# EAGLE design DIGITAL_40G_ACCELEROMETER_REV_1 (EAGLE 9.6.2)
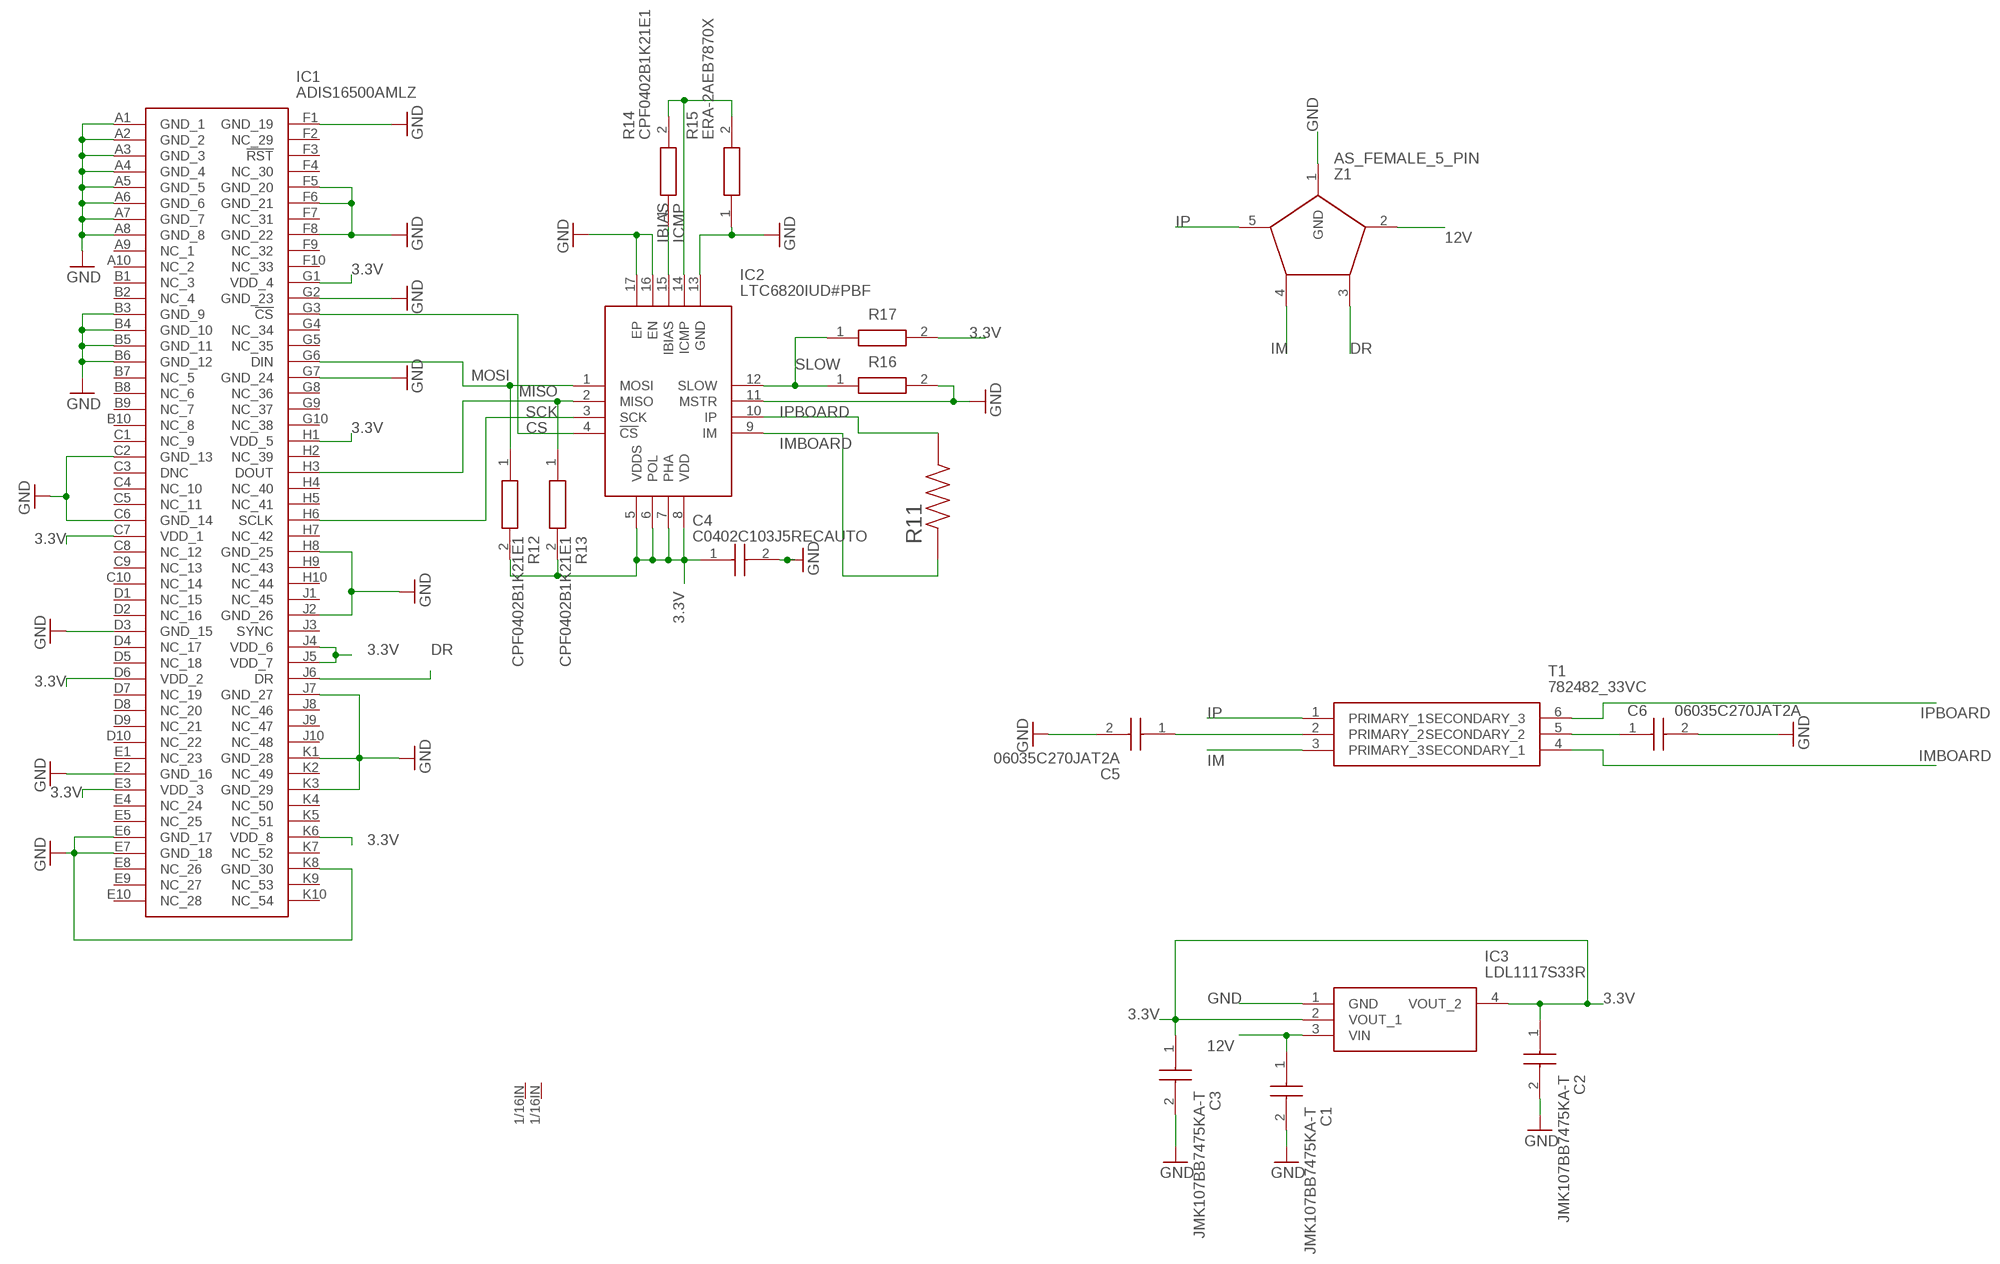
[diagram p0: schematic, sheet 1]

## Parts
C1  JMK107BB7475KA-T  [CAPC1608X90N]
C2  JMK107BB7475KA-T  [CAPC1608X90N]
C3  JMK107BB7475KA-T  [CAPC1608X90N]
C4  C0402C103J5RECAUTO  [CAPC1005X55N]
C5  06035C270JAT2A  [CAPC1608X90N]
C6  06035C270JAT2A  [CAPC1608X90N]
IC1  ADIS16500AMLZ  [BGA100C127P10X10_1500X1500X608]
IC2  LTC6820IUD#PBF  [QFN50P300X300X80-17N]
IC3  LDL1117S33R  [SOT230P700X180-4N]
R11  100  TNPW0402100RBYEP  [RESC1005X40N]
R12  CPF0402B1K21E1  [RESC1005X35N]
R13  CPF0402B1K21E1  [RESC1005X35N]
R14  CPF0402B1K21E1  [RESC1005X35N]
R15  ERA-2AEB7870X  [ERA2AED122X]
R16  CRG0402ZR  [RESC1005X40N]
R17  CRG0402ZR  [RESC1005X40N]
T1  782482_33VC  [DIP1016W60P254L914H635Q6N]
U$3  THROUGH_HOLE  [1/16TH_BOLT]
U$4  THROUGH_HOLE  [1/16TH_BOLT]
Z1  AS_FEMALE_5_PIN  [AS_FEMALE_5_PIN]

## Nets
3.3V: C2.1 C3.1 C4.1 IC1.C7(VDD_1) IC1.D6(VDD_2) IC1.E3(VDD_3) IC1.G1(VDD_4) IC1.H1(VDD_5) IC1.J4(VDD_6) IC1.J5(VDD_7) IC1.K6(VDD_8) IC2.5(VDDS) IC2.6(POL) IC2.7(PHA) IC2.8(VDD) IC3.2(VOUT_1) IC3.4(VOUT_2) R12.2 R13.2 R17.2
12V: C1.1 IC3.3(VIN) Z1.2
CS: IC1.G3(!CS) IC2.4(!CS)
DR: IC1.J6(DR) Z1.3
GND: C1.2 C2.2 C3.2 C4.2 C5.2 C6.2 IC1.A1(GND_1) IC1.A2(GND_2) IC1.A3(GND_3) IC1.A4(GND_4) IC1.A5(GND_5) IC1.A6(GND_6) IC1.A7(GND_7) IC1.A8(GND_8) IC1.B3(GND_9) IC1.B4(GND_10) IC1.B5(GND_11) IC1.B6(GND_12) IC1.C2(GND_13) IC1.C6(GND_14) IC1.D3(GND_15) IC1.E2(GND_16) IC1.E6(GND_17) IC1.E7(GND_18) IC1.F1(GND_19) IC1.F5(GND_20) IC1.F6(GND_21) IC1.F8(GND_22) IC1.G2(GND_23) IC1.G7(GND_24) IC1.H8(GND_25) IC1.J2(GND_26) IC1.J7(GND_27) IC1.K1(GND_28) IC1.K3(GND_29) IC1.K8(GND_30) IC2.11(MSTR) IC2.13(GND) IC2.16(EN) IC2.17(EP) IC3.1(GND) R15.1 R16.2 Z1.1(GND)
IBIAS: IC2.15(IBIAS) R14.1
ICMP: IC2.14(ICMP) R14.2 R15.2
IM: T1.3(PRIMARY_3) Z1.4
IMBOARD: IC2.9(IM) R11.1 T1.4(SECONDARY_1)
IP: T1.1(PRIMARY_1) Z1.5
IPBOARD: IC2.10(IP) R11.2 T1.6(SECONDARY_3)
MISO: IC1.H3(DOUT) IC2.2(MISO) R13.1
MOSI: IC1.G6(DIN) IC2.1(MOSI) R12.1
N$1: C6.1 T1.5(SECONDARY_2)
N$2: C5.1 T1.2(PRIMARY_2)
SCK: IC1.H6(SCLK) IC2.3(SCK)
SLOW: IC2.12(SLOW) R16.1 R17.1
Unconnected: IC1.A9(NC_1) IC1.A10(NC_2) IC1.B1(NC_3) IC1.B2(NC_4) IC1.B7(NC_5) IC1.B8(NC_6) IC1.B9(NC_7) IC1.B10(NC_8) IC1.C1(NC_9) IC1.C3(DNC) IC1.C4(NC_10) IC1.C5(NC_11) IC1.C8(NC_12) IC1.C9(NC_13) IC1.C10(NC_14) IC1.D1(NC_15) IC1.D2(NC_16) IC1.D4(NC_17) IC1.D5(NC_18) IC1.D7(NC_19) IC1.D8(NC_20) IC1.D9(NC_21) IC1.D10(NC_22) IC1.E1(NC_23) IC1.E4(NC_24) IC1.E5(NC_25) IC1.E8(NC_26) IC1.E9(NC_27) IC1.E10(NC_28) IC1.F2(NC_29) IC1.F3(!RST) IC1.F4(NC_30) IC1.F7(NC_31) IC1.F9(NC_32) IC1.F10(NC_33) IC1.G4(NC_34) IC1.G5(NC_35) IC1.G8(NC_36) IC1.G9(NC_37) IC1.G10(NC_38) IC1.H2(NC_39) IC1.H4(NC_40) IC1.H5(NC_41) IC1.H7(NC_42) IC1.H9(NC_43) IC1.H10(NC_44) IC1.J1(NC_45) IC1.J3(SYNC) IC1.J8(NC_46) IC1.J9(NC_47) IC1.J10(NC_48) IC1.K2(NC_49) IC1.K4(NC_50) IC1.K5(NC_51) IC1.K7(NC_52) IC1.K9(NC_53) IC1.K10(NC_54) U$3.1/16IN(THROUGH_HOLE) U$4.1/16IN(THROUGH_HOLE)

## Library data of the parts
C1-C3 = SamacSys_Parts:JMK107BB7475KA-T: Taiyo Yuden JMK107BB7475KA-T 4.7F MLCC 6.3V dc +/-10% Tolerance SMD Source: Datasheet <https://componentsearchengine.com/Datasheets/1/JMK107BB7475KA-T.pdf>; DESCRIPTION: Taiyo Yuden JMK107BB7475KA-T 4.7F MLCC 6.3V dc +/-10% Tolerance SMD; HEIGHT: 0.9mm; MANUFACTURER_NAME: TAIYO YUDEN; MANUFACTURER_PART_NUMBER: JMK107BB7475KA-T; MOUSER_PART_NUMBER: 963-JMK107BB7475KA-T; MOUSER_PRICE-STOCK: https://www.mouser.co.uk/ProductDetail/Taiyo-Yuden/JMK107BB7475KA-T/?qs=Va%252BXcMGJzEswq6AuVGoq3Q%3D%3D
C4 = SamacSys_Parts:C0402C103J5RECAUTO: Multilayer Ceramic Capacitors MLCC - SMD/SMT 50V 0.01uF X7R 0402 5% AEC-Q200 Source: Datasheet <https://www.kemet.com/specsheet/C0402C103J5RECAUTO>; DESCRIPTION: Multilayer Ceramic Capacitors MLCC - SMD/SMT 50V 0.01uF X7R 0402 5% AEC-Q200; HEIGHT: 0.55mm; MANUFACTURER_NAME: Kemet; MANUFACTURER_PART_NUMBER: C0402C103J5RECAUTO; MOUSER_PART_NUMBER: 80-C0402C103J5RECAUT; MOUSER_PRICE-STOCK: https://www.mouser.co.uk/ProductDetail/KEMET/C0402C103J5RECAUTO?qs=MLItCLRbWsyFnqqp7gkmMQ%3D%3D
C5 C6 = SamacSys_Parts:06035C270JAT2A: Capacitor, 0603 27PF +/-5% 50V Source: Datasheet <https://componentsearchengine.com/Datasheets/1/06031A100FAT2A.pdf>; DESCRIPTION: Capacitor, 0603 27PF +/-5% 50V; HEIGHT: 0.9mm; MANUFACTURER_NAME: AVX; MANUFACTURER_PART_NUMBER: 06035C270JAT2A
IC1 = SamacSys_Parts:ADIS16500AMLZ: IMUs - Inertial Measurement Units 6 DOF Prec IMU, 40g (2000 DPS DNR) Source: Datasheet <https://componentsearchengine.com/Datasheets/1/ADIS16500AMLZ.pdf>; DESCRIPTION: IMUs - Inertial Measurement Units 6 DOF Prec IMU, 40g (2000 DPS DNR); HEIGHT: 6.077mm; MANUFACTURER_NAME: Analog Devices; MANUFACTURER_PART_NUMBER: ADIS16500AMLZ; MOUSER_PART_NUMBER: 584-ADIS16500AMLZ; MOUSER_PRICE-STOCK: https://www.mouser.co.uk/ProductDetail/Analog-Devices/ADIS16500AMLZ?qs=wnTfsH77Xs6CVAUqSdwQ2w%3D%3D
IC2 = SamacSys_Parts:LTC6820IUD#PBF: Interface - Specialized isoSPI Iso Communications Int Source: Datasheet <https://www.analog.com/media/en/technical-documentation/data-sheets/6820fb.pdf>; DESCRIPTION: Interface - Specialized isoSPI Iso Communications Int; HEIGHT: 0.8mm; MANUFACTURER_NAME: Analog Devices; MANUFACTURER_PART_NUMBER: LTC6820IUD#PBF; MOUSER_PART_NUMBER: 584-LTC6820IUD#PBF; MOUSER_PRICE-STOCK: https://www.mouser.co.uk/ProductDetail/Analog-Devices/LTC6820IUDPBF?qs=hVkxg5c3xu96S49pvln6gg%3D%3D
IC3 = SamacSys_Parts:LDL1117S33R: STMICROELECTRONICS - LDL1117S33R - LDO, FIXED, 3.3V, 1.2A, SOT-223-3 Source: Datasheet <https://componentsearchengine.com/Datasheets/2/LDL1117S33R.pdf>; DESCRIPTION: STMICROELECTRONICS - LDL1117S33R - LDO, FIXED, 3.3V, 1.2A, SOT-223-3; HEIGHT: 1.8mm; MANUFACTURER_NAME: STMicroelectronics; MANUFACTURER_PART_NUMBER: LDL1117S33R; MOUSER_PART_NUMBER: 511-LDL1117S33R; MOUSER_PRICE-STOCK: https://www.mouser.co.uk/ProductDetail/STMicroelectronics/LDL1117S33R?qs=AQlKX63v8Rt9Bf6AWSrbFg%3D%3D
R11 = SamacSys_Parts:TNPW0402100RBYEP: Check availability <https://pricing.snapeda.com/parts/TNPW0402100RBYEP/Vishay/view-part?ref=eda>; AVAILABILITY: In Stock; DESCRIPTION: 100 Ohms ±0.1% 0.063W, 1/16W Chip Resistor 0402 (1005 Metric) Anti-Sulfur, Automotive AEC-Q200, Moisture Resistant Thin Film; MF: Vishay; MP: TNPW0402100RBYEP; PACKAGE: 1005 Stackpole; PRICE: None; PURCHASE-URL: https://pricing.snapeda.com/search/part/TNPW0402100RBYEP/?ref=eda
R12-R14 = SamacSys_Parts:CPF0402B1K21E1: TE Connectivity CPF Series Precision Thin Film Surface Mount Resistor 0402 Case 1.21k +/-0.1% 0.063W +/-25ppm/C Source: Datasheet; DESCRIPTION: TE Connectivity CPF Series Precision Thin Film Surface Mount Resistor 0402 Case 1.21k +/-0.1% 0.063W +/-25ppm/C; HEIGHT: 0.35mm; MANUFACTURER_NAME: TE Connectivity; MANUFACTURER_PART_NUMBER: CPF0402B1K21E1
R15 = SamacSys_Parts:ERA-2AEB7870X: Metal Thin Film Chip Resistor, 0402, 0.063W Source: Datasheet <http://industrial.panasonic.com/cdbs/www-data/pdf/RDM0000/AOA0000C307.pdf>; DESCRIPTION: Metal Thin Film Chip Resistor, 0402, 0.063W; HEIGHT: 0.4mm; MANUFACTURER_NAME: Panasonic; MANUFACTURER_PART_NUMBER: ERA-2AEB7870X
R16 R17 = SamacSys_Parts:CRG0402ZR: 0 0402 Thick Film Surface Mount Fixed Resistor +/-0% 0.063W CRG0402ZR Source: Datasheet <https://www.te.com/commerce/DocumentDelivery/DDEController?Action=showdoc&DocId=Data Sheet1773204JpdfEnglishENG_DS_1773204_J.pdf6-1622826-4>; DESCRIPTION: 0 0402 Thick Film Surface Mount Fixed Resistor +/-0% 0.063W CRG0402ZR; HEIGHT: 0.4mm; MANUFACTURER_NAME: TE Connectivity; MANUFACTURER_PART_NUMBER: CRG0402ZR; MOUSER_PART_NUMBER: 279-CRG0402ZR; MOUSER_PRICE-STOCK: https://www.mouser.co.uk/ProductDetail/TE-Connectivity-Holsworthy/CRG0402ZR?qs=n4i9pByFsMS7bfq5JAG5yw%3D%3D
T1 = SamacSys_Parts:782482_33VC: 1:1.33 Through Hole Telecom Transformer, 310uH, 600m Source: Datasheet <https://www.murata-ps.com/data/magnetics/kmp_782482.pdf>; DESCRIPTION: 1:1.33 Through Hole Telecom Transformer, 310uH, 600m; HEIGHT: 6.35mm; MANUFACTURER_NAME: Murata Electronics; MANUFACTURER_PART_NUMBER: 782482/33VC; MOUSER_PART_NUMBER: 580-782482/33VC; MOUSER_PRICE-STOCK: https://www.mouser.co.uk/ProductDetail/Murata-Power-Solutions/782482-33VC?qs=2G8o3QlzqXp4rFQDC5ba8Q%3D%3D
U$3 U$4 = SamacSys_Parts:THROUGH_HOLE
Z1 = SamacSys_Parts:AS_FEMALE_5_PIN

## Board
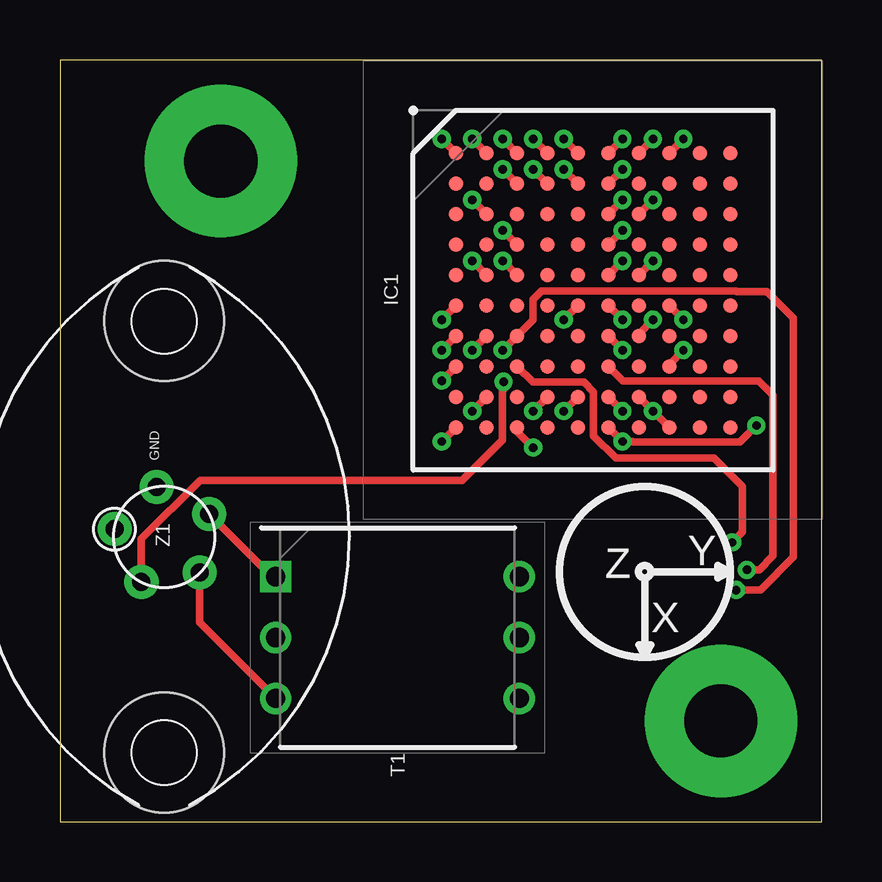
[diagram p1: board, top side]
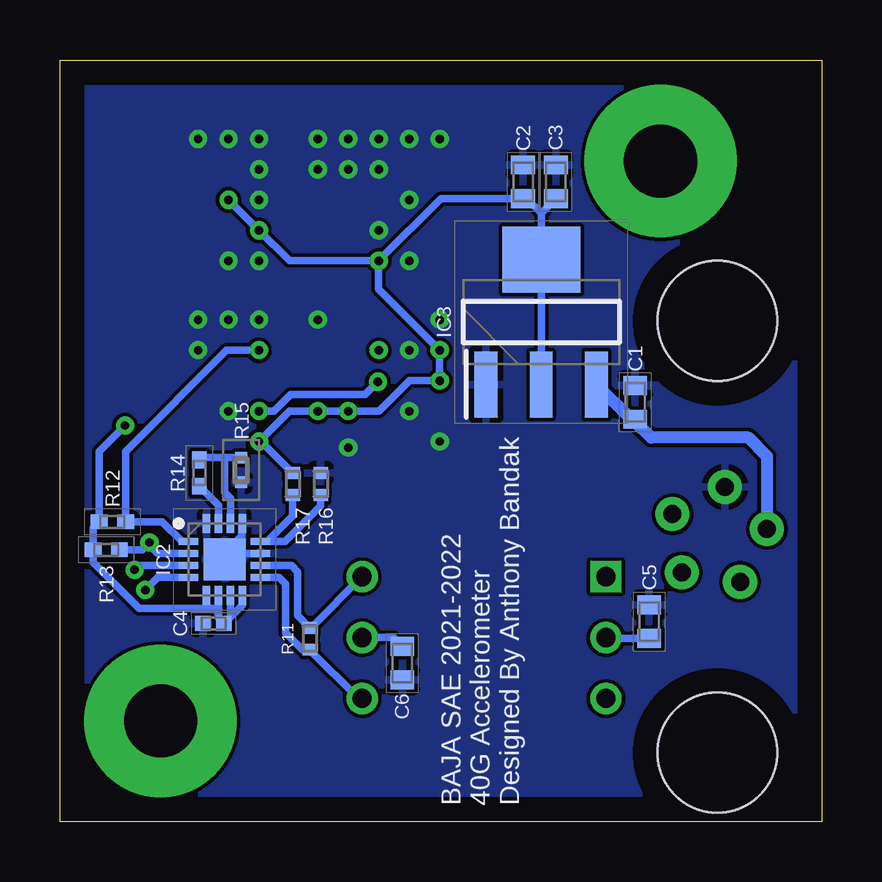
[diagram p2: board, bottom side, seen from below]

Size 31.75 x 31.75 mm. Coordinates in mm from the lower left corner, seen from the top.
Outline: 0,0 31.75,0 31.75,31.75 0,31.75 0,0
Copper layers (1*16): Top 0.035mm / dielectric 0.2mm / Bottom 0.035mm
Design rules "default *": minimum track width 6mil, minimum drill 0.35mm, track to track 6mil, track to pad 6mil, pad to pad 6mil, via to via 6mil, smd to smd 6mil, copper to edge 40mil, drill to drill 6mil, minimum pad ring 10mil, minimum via ring 8mil, stop-mask expansion 4mil, vias tented up to drill 20mil, thermal gap 10mil

### Footprints (pad centres in the part's own frame; a part is rotated, then mirrored left to right if it is on the bottom)
CAPC1608X90N = smd 0.78 x 0.99: 1 -0.7,0; 2 0.7,0
CAPC1005X55N = smd 0.65 x 0.62: 1 -0.44,0; 2 0.44,0
BGA100C127P10X10_1500X1500X608 = smd 0.612 x 0.612: A1 -5.715,5.715; A2 -4.445,5.715; A3 -3.175,5.715; A4 -1.905,5.715; A5 -0.635,5.715; A6 0.635,5.715; A7 1.905,5.715; A8 3.175,5.715; A9 4.445,5.715; A10 5.715,5.715; B1 -5.715,4.445; B2 -4.445,4.445; B3 -3.175,4.445; B4 -1.905,4.445; B5 -0.635,4.445; B6 0.635,4.445; B7 1.905,4.445; B8 3.175,4.445; B9 4.445,4.445; B10 5.715,4.445; C1 -5.715,3.175; C2 -4.445,3.175; C3 -3.175,3.175; C4 -1.905,3.175; C5 -0.635,3.175; C6 0.635,3.175; C7 1.905,3.175; C8 3.175,3.175; C9 4.445,3.175; C10 5.715,3.175; D1 -5.715,1.905; D2 -4.445,1.905; D3 -3.175,1.905; D4 -1.905,1.905; D5 -0.635,1.905; D6 0.635,1.905; D7 1.905,1.905; D8 3.175,1.905; D9 4.445,1.905; D10 5.715,1.905; E1 -5.715,0.635; E2 -4.445,0.635; E3 -3.175,0.635; E4 -1.905,0.635; E5 -0.635,0.635; E6 0.635,0.635; E7 1.905,0.635; E8 3.175,0.635; E9 4.445,0.635; E10 5.715,0.635; F1 -5.715,-0.635; F2 -4.445,-0.635; F3 -3.175,-0.635; F4 -1.905,-0.635; F5 -0.635,-0.635; F6 0.635,-0.635; F7 1.905,-0.635; F8 3.175,-0.635; F9 4.445,-0.635; F10 5.715,-0.635; G1 -5.715,-1.905; G2 -4.445,-1.905; G3 -3.175,-1.905; G4 -1.905,-1.905; G5 -0.635,-1.905; G6 0.635,-1.905; G7 1.905,-1.905; G8 3.175,-1.905; G9 4.445,-1.905; G10 5.715,-1.905; H1 -5.715,-3.175; H2 -4.445,-3.175; H3 -3.175,-3.175; H4 -1.905,-3.175; H5 -0.635,-3.175; H6 0.635,-3.175; H7 1.905,-3.175; H8 3.175,-3.175; H9 4.445,-3.175; H10 5.715,-3.175; J1 -5.715,-4.445; J2 -4.445,-4.445; J3 -3.175,-4.445; J4 -1.905,-4.445; J5 -0.635,-4.445; J6 0.635,-4.445; J7 1.905,-4.445; J8 3.175,-4.445; J9 4.445,-4.445; J10 5.715,-4.445; K1 -5.715,-5.715; K2 -4.445,-5.715; K3 -3.175,-5.715; K4 -1.905,-5.715; K5 -0.635,-5.715; K6 0.635,-5.715; K7 1.905,-5.715; K8 3.175,-5.715; K9 4.445,-5.715; K10 5.715,-5.715
QFN50P300X300X80-17N = smd 0.8 x 0.3: 1 -1.5,0.75; 2 -1.5,0.25; 3 -1.5,-0.25; 4 -1.5,-0.75; 9 1.5,-0.75; 10 1.5,-0.25; 11 1.5,0.25; 12 1.5,0.75 | smd 0.3 x 0.8: 5 -0.75,-1.5; 6 -0.25,-1.5; 7 0.25,-1.5; 8 0.75,-1.5; 13 0.75,1.5; 14 0.25,1.5; 15 -0.25,1.5; 16 -0.75,1.5 | smd 1.75 x 1.75: 17 0,0
SOT230P700X180-4N = smd 2.75 x 0.95: 1 -2.6,2.3; 2 -2.6,0; 3 -2.6,-2.3 | smd 2.75 x 3.25: 4 2.6,0
RESC1005X40N = smd 0.49 x 0.6: 1 -0.457,0; 2 0.457,0
RESC1005X35N = smd 0.7 x 0.6: 1 -0.55,0; 2 0.55,0
ERA2AED122X = smd 0.475 x 0.5: 1 -0.512,0; 2 0.512,0
DIP1016W60P254L914H635Q6N = drill 0.8 pad 1.2 square: 1 -5.08,2.54 | drill 0.8 pad 1.2: 2 -5.08,0; 3 -5.08,-2.54; 4 5.08,-2.54; 5 5.08,0; 6 5.08,2.54
1/16TH_BOLT = drill 3.048 pad 6.35: 1/16IN 0,0
AS_FEMALE_5_PIN = drill 0.75 pad 1.422: 1 2.009,0.37; 2 0.259,2.12; 3 -1.941,1; 4 -1.551,-1.43; 5 0.879,-1.82 | hole 5: 8.929,0.05; -9.071,0.05

### Placement (x,y rotation side)
C1  7.77,17.48 90 bottom
C2  12.45,26.67 90 bottom
C3  11.07,26.67 90 bottom
C4  25.35,8.26 180 bottom
C5  7.19,8.33 90 bottom
C6  17.48,6.6 270 bottom
IC1  22.23,22.15 0 top
IC2  24.89,10.92 0 bottom
IC3  11.68,20.83 90 bottom
R11  21.34,7.62 90 bottom
R12  29.57,12.5 180 bottom
R13  29.82,11.33 180 bottom
R14  25.93,14.53 90 bottom
R15  24.21,14.66 90 bottom
R16  20.88,14.07 90 bottom
R17  22.05,14.07 90 bottom
T1  14.07,7.67 0 top
U$3  6.71,27.53 180 bottom
U$4  27.56,4.19 0 top
Z1  4.39,11.94 90 top

### Tracks (layer width: path | path; a pad name or v marks a point on that pad's centre or on a via)
3.3V  (via drill 0.35)
  Top 0.305: IC1.C7 v24.72,25.91 | IC1.D6 v23.45,24.64 | IC1.E3 v18.46,23.38 | IC1.G1 v15.92,19.65 | IC1.H1 v15.92,18.38 | IC1.J4 v19.73,17.11 | IC1.J5 v21,17.11 | IC1.K6 v23.45,15.84 23.86,15.84 23.88,15.82 28.35,15.82 v29.04,16.51
  Bottom 0.305: 11.68,25.36 IC3.4 IC3.2 | 11.68,25.36 C3.1 | 11.68,25.36 12.29,25.97 C2.1 15.86,25.97 v18.46,23.38 | C4.1 24.14,9.02 IC2.8 | IC2.7 24.64,8.52 C4.1 | IC2.6 25.14,8.49 | 25.14,8.49 C4.1 | IC2.5 25.64,8.88 25.65,8.87 25.34,8.87 | 25.34,8.87 25.16,8.69 25.16,8.51 25.14,8.49 | v24.72,25.91 v23.45,24.64 22.18,23.38 v18.46,23.38 | v18.46,23.38 18.46,22.19 v15.92,19.65 v15.92,18.38 17.18,18.38 18.45,17.11 v19.73,17.11 v21,17.11 22.18,17.11 v23.45,15.84 23.36,15.84 R17.2 | 25.34,8.87 25.36,8.89 28.45,8.89 30.37,10.81 R13.2 30.37,12.24 R12.2 30.12,15.43 v29.04,16.51
12V
  Bottom 0.508: Z1.2 2.27,15.23 3.05,16 7.11,16 7.77,16.66 C1.1 7.93,16.77 IC3.3
CS  (via drill 0.35)
  Top 0.305: v18.46,19.65 IC1.G3 19.71,20.9 19.71,21.77 20.07,22.12 28.19,22.12 28.22,22.1 29.46,22.1 30.58,20.98 30.58,11.02 29.21,9.65 v28.19,9.65
  Bottom 0.305: IC2.4 27.67,10.17 v28.19,9.65
DR  (via drill 0.35)
  Top 0.305: IC1.J6 v23.45,17.11 | v18.5,18.33 18.5,18.01 18.44,17.96 18.44,15.9 16.76,14.22 5.84,14.22 3.39,11.78 Z1.3
  Bottom 0.305: v23.45,17.11 22.83,17.11 22.14,17.8 19.04,17.8 v18.5,18.33
GND  (via drill 0.35)
  Top 0.305: IC1.A1 v15.92,28.45 | IC1.A2 v17.19,28.45 | IC1.A3 v18.46,28.45 | IC1.A4 v19.73,28.45 | IC1.A5 v21,28.45 | IC1.A6 v23.45,28.45 | IC1.A7 v24.72,28.45 | IC1.A8 v25.99,28.45 | IC1.B3 v18.46,27.18 | IC1.B4 v19.73,27.18 | IC1.B5 v21,27.18 | IC1.B6 v23.45,27.18 | IC1.C2 v17.19,25.91 | IC1.C6 v23.45,25.91 | IC1.D3 v18.46,24.64 | IC1.E2 v17.19,23.38 | IC1.E6 v23.45,23.38 | IC1.E7 v24.72,23.38 | IC1.F1 v15.92,20.92 | IC1.F5 v21,20.92 | IC1.F6 v23.45,20.92 | IC1.F8 v25.99,20.92 | IC1.G2 v17.19,19.65 | IC1.G7 24.13,20.33 v24.72,20.92 | IC1.H8 25.4,19.06 v25.99,19.65 | IC1.J2 v17.19,17.11 | IC1.J7 v24.72,17.11 IC1.K8 | IC1.K1 v15.92,15.84 | v19.73,15.59 19.05,16.27 IC1.K3
  Bottom 0.305: IC2.13 24.18,12.38 24.18,11.9 24.89,11.19 IC2.17 24.64,11.17 IC2.11
  pour Bottom: 0,31.75 31.75,31.75 31.75,0 0,0
IBIAS
  Bottom 0.305: R14.1 25.14,13.19 IC2.15
ICMP
  Bottom 0.305: R15.2 24.89,15.17 | 24.89,15.17 25.84,15.17 R14.2 | IC2.14 24.64,13.46 24.89,13.72 24.89,15.17
IM
  Top 0.305: Z1.4 5.82,8.3 T1.3
IMBOARD
  Bottom 0.305: T1.4 19.3,5.13 R11.1 21.64,7.16 22.35,7.87 22.35,9.91 22.62,10.17 IC2.9
IP
  Top 0.305: Z1.5 8.82,10.21 T1.1
IPBOARD
  Bottom 0.305: T1.6 21.29,8.08 R11.2 21.84,8.59 21.84,10.41 22.1,10.67 IC2.10
MISO  (via drill 0.35)
  Top 0.305: v28.02,11.63 28.45,12.06 28.45,13.97 27.26,15.16 23.17,15.16 22.25,16.08 22.25,17.91 21.84,18.32 19.71,18.32 IC1.H3
  Bottom 0.305: IC2.2 27.68,11.17 27.69,11.18 28.08,11.57 | R13.1 28.33,11.33 28.08,11.57 | 28.08,11.57 v28.02,11.63
MOSI  (via drill 0.35)
  Top 0.305: IC1.G6 v23.45,19.65
  Bottom 0.305: IC2.1 26.66,11.67 27.48,12.5 R12.1 29.02,15.43 24.8,19.65 v23.45,19.65
N$1
  Bottom 0.305: C6.1 17.84,7.67 T1.5
N$2
  Bottom 0.305: C5.1 8.95,7.63 T1.2
SCK  (via drill 0.35)
  Top 0.305: v28.64,10.49 29.15,10.49 29.72,11.06 29.72,17.78 29.14,18.36 23.47,18.36 IC1.H6
  Bottom 0.305: IC2.3 28.46,10.67 v28.64,10.49
SLOW
  Bottom 0.305: R16.1 20.88,13.16 22.36,11.67 23.11,11.67 | 23.11,11.67 IC2.12 | R17.1 22.05,12.74 23.11,11.67

### Text on the board
tNames: Y | Z | X
bNames: BAJA SAE 2021-2022 / 40G Accelerometer / Designed By Anthony Bandak